# Altium schematic sheet led_matrix_board.SchDoc: MMECH23
size A3; DrawnBy: J. Garnier; SheetNumber: 1; SheetTotal: 1; PageSetup: Record=PageOptions|CenterHorizontal=True|CenterVertical=True|PrintScale=1.04|XCorrection=1.00|YCorrection=1.00|PrintKind=0|BorderSize=5000000|LeftOffset=0|BottomOffset=0|Orientation=2|PaperLength=1000|PaperWidth=1000|Scale=100|PaperSource=7|PrintQuality=-4|MediaType=1|DitherType=10|PaperKind=A3|PrintScaleMode=1
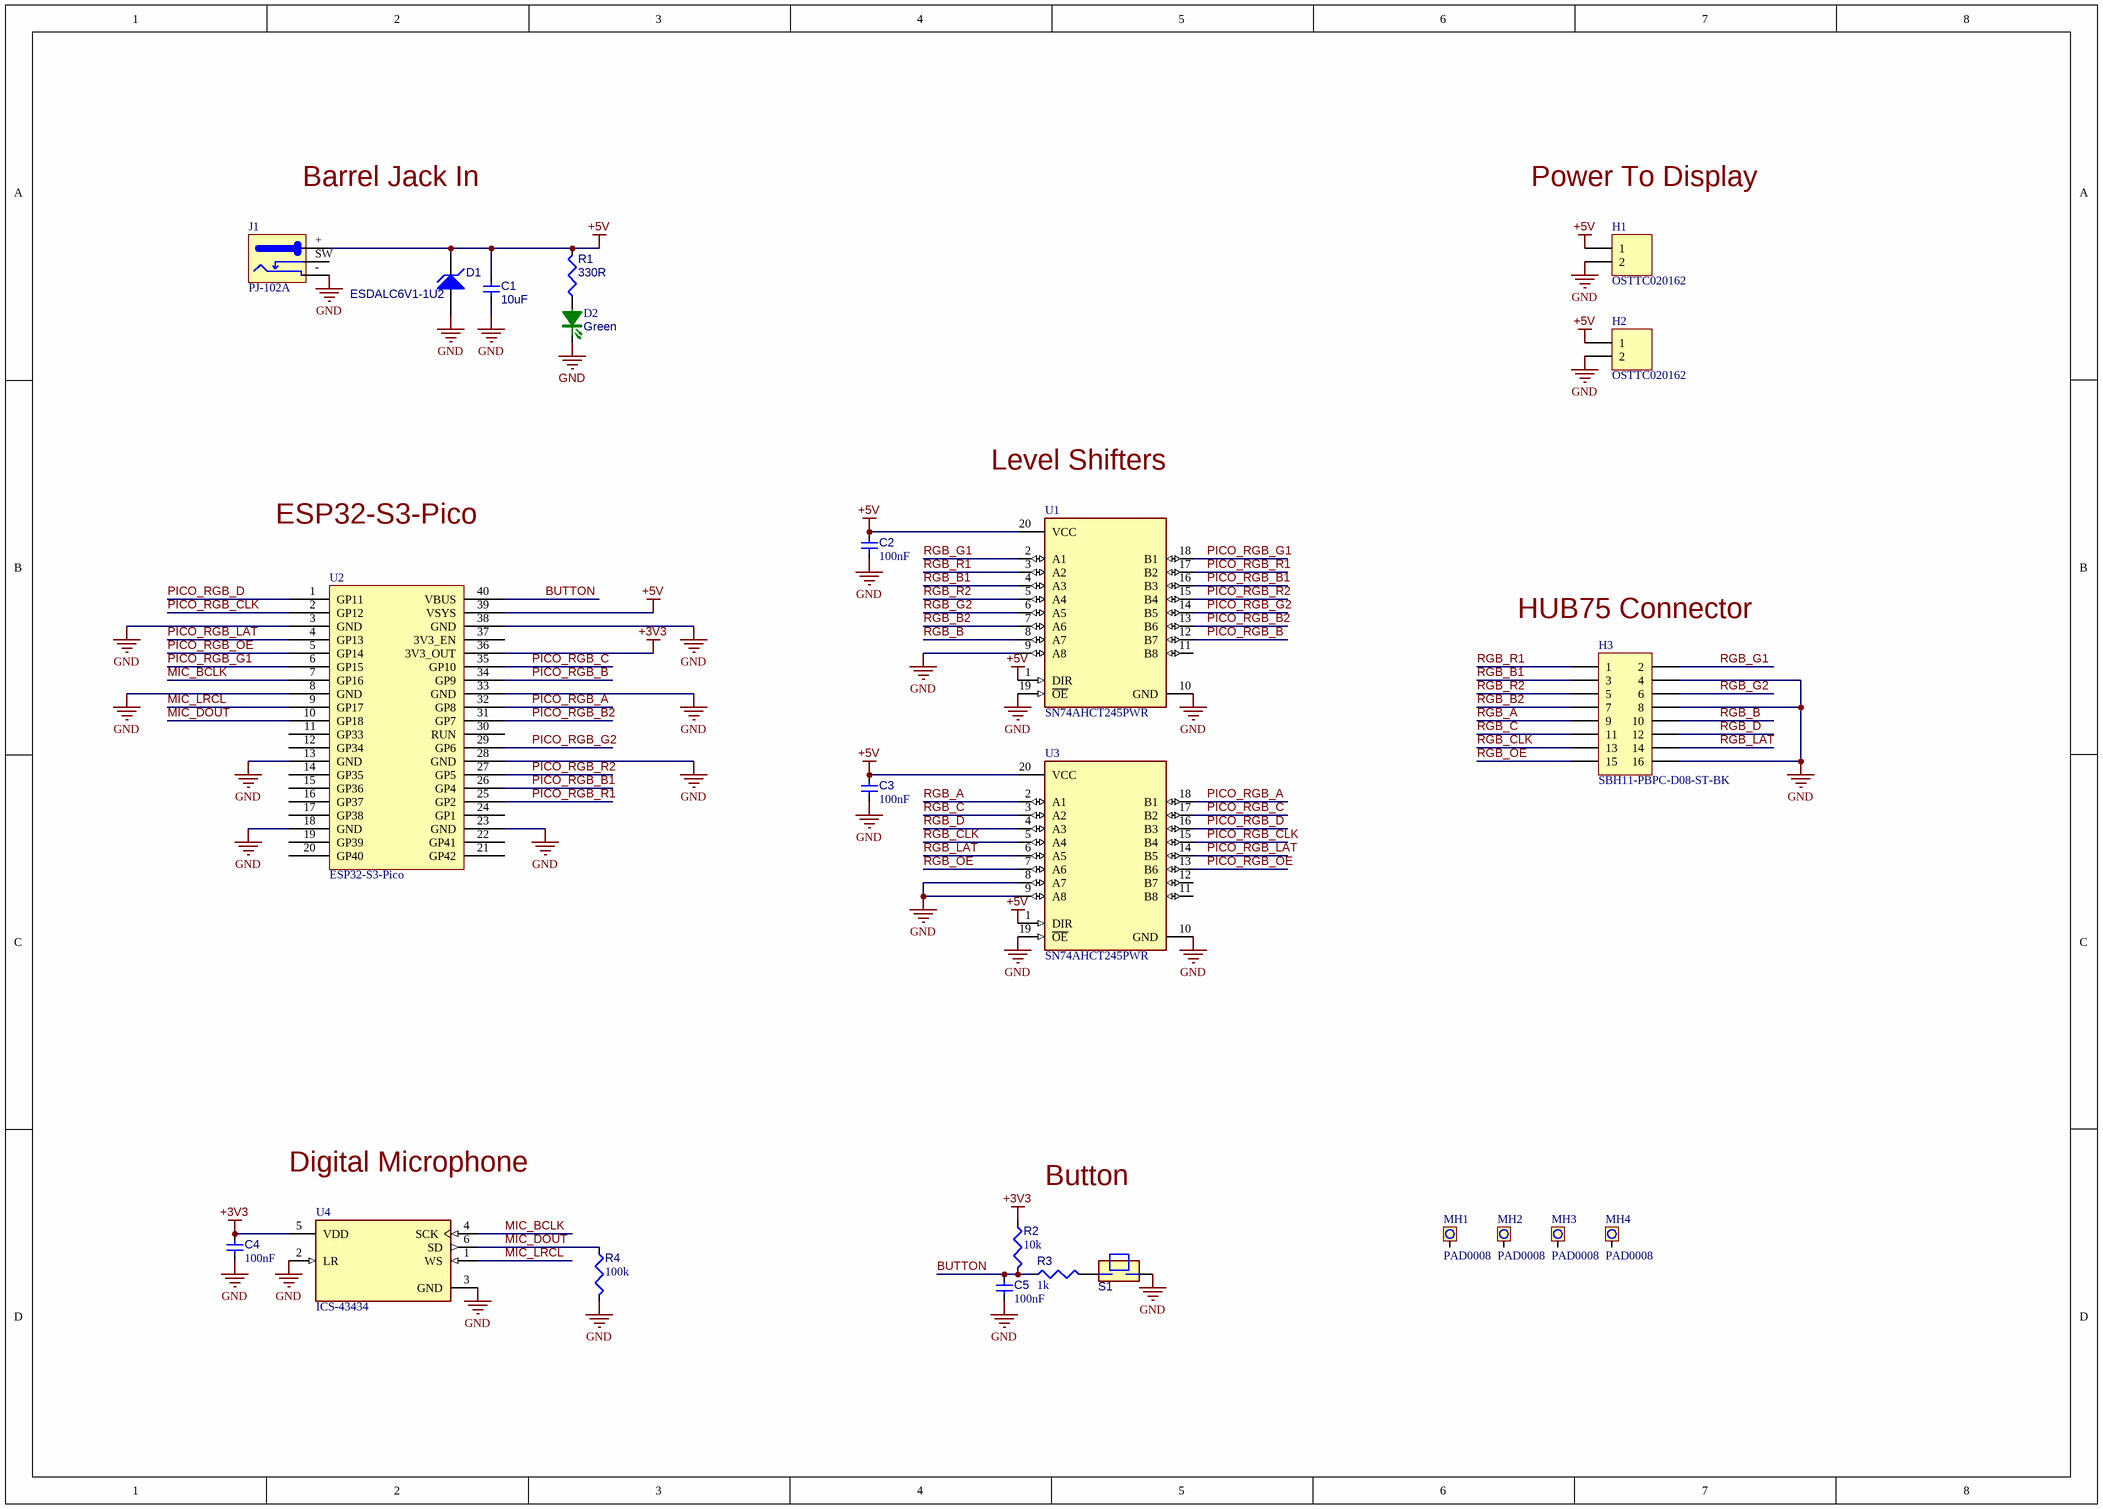
[diagram p0: led_matrix_board.SchDoc]

## Parts
C1  value 10uF  [0603_cap_rnd]  (hidden comment: GRM188R61E106MA73J)
C2  value 100nF  [0603_cap]  (hidden comment: C0603C104K8RACTU)
C3  value 100nF  [0603_cap]  (hidden comment: C0603C104K8RACTU)
C4  value 100nF  [0603_cap]  (hidden comment: C0603C104K8RACTU)
C5  value 100nF  [0603_cap]  (hidden comment: C0603C104K8RACTU)
D1  ESDALC6V1-1U2  [0201_DIODE]
D2  value Green  [LED_0402_GREEN]  (hidden comment: XZVGR68W-3)
H1  OSTTC020162  [SCREW_TERM_2WAY_5MM]
H2  OSTTC020162  [SCREW_TERM_2WAY_5MM]
H3  SBH11-PBPC-D08-ST-BK  [FP-SBH11-PBPC-D08-ST-BK-MFG]
J1  PJ-102A  [PJ-102A]
MH1  PAD0008  [MH_600_320_NPTH]
MH2  PAD0008  [MH_600_320_NPTH]
MH3  PAD0008  [MH_600_320_NPTH]
MH4  PAD0008  [MH_600_320_NPTH]
R1  value 330R  [0402_res]  (hidden comment: MCR01MZPF3300)
R2  value 10k  [0603_res]  (hidden comment: 0603WAF1002T5E)
R3  value 1k  [0603_res]  (hidden comment: ERA-3AEB102V)
R4  value 100k  [0603_res]  (hidden comment: 0603WAF1003T5E)
S1  EVQ-PF206K  [EVQ-PF206K]  (value not drawn)
U1  SN74AHCT245PWR  [FP-PW0020A-IPC_A]
U2  ESP32-S3-Pico  [ESP32-S3-Pico]
U3  SN74AHCT245PWR  [FP-PW0020A-IPC_A]
U4  ICS-43434  [FP-ICS-43434-MFG]

## Nets
+3V3: C4.1 R2.1 U2.36(3V3_OUT) U4.5(VDD)
+5V: C1.1 C2.1 C3.1 D1.K H1.1 H2.1 J1.+ R1.2 U1.1(DIR) U1.20(VCC) U2.39(VSYS) U3.1(DIR) U3.20(VCC)
GND: C1.2 C2.2 C3.2 C4.2 C5.2 D1.A D2.K H1.2 H2.2 H3.4 H3.8 H3.16 J1.- R4.2 S1.2 U1.9(A8) U1.10(GND) U1.19(~{OE}) U2.3(GND) U2.8(GND) U2.13(GND) U2.18(GND) U2.23(GND) U2.28(GND) U2.33(GND) U2.38(GND) U3.8(A7) U3.9(A8) U3.10(GND) U3.19(~{OE}) U4.2(LR) U4.3(GND)
BUTTON: C5.1 R2.2 R3.1 U2.40(VBUS)
MIC_BCLK: U2.7(GP16) U4.4(SCK)
MIC_DOUT: R4.1 U2.10(GP18) U4.6(SD)
MIC_LRCL: U2.9(GP17) U4.1(WS)
PICO_RGB_A: U2.32(GP8) U3.18(B1)
PICO_RGB_B: U1.12(B7) U2.34(GP9)
PICO_RGB_B1: U1.16(B3) U2.26(GP4)
PICO_RGB_B2: U1.13(B6) U2.31(GP7)
PICO_RGB_C: U2.35(GP10) U3.17(B2)
PICO_RGB_CLK: U2.2(GP12) U3.15(B4)
PICO_RGB_D: U2.1(GP11) U3.16(B3)
PICO_RGB_G1: U1.18(B1) U2.6(GP15)
PICO_RGB_G2: U1.14(B5) U2.29(GP6)
PICO_RGB_LAT: U2.4(GP13) U3.14(B5)
PICO_RGB_OE: U2.5(GP14) U3.13(B6)
PICO_RGB_R1: U1.17(B2) U2.25(GP2)
PICO_RGB_R2: U1.15(B4) U2.27(GP5)
RGB_A: H3.9 U3.2(A1)
RGB_B: H3.10 U1.8(A7)
RGB_B1: H3.3 U1.4(A3)
RGB_B2: H3.7 U1.7(A6)
RGB_C: H3.11 U3.3(A2)
RGB_CLK: H3.13 U3.5(A4)
RGB_D: H3.12 U3.4(A3)
RGB_G1: H3.2 U1.2(A1)
RGB_G2: H3.6 U1.6(A5)
RGB_LAT: H3.14 U3.6(A5)
RGB_OE: H3.15 U3.7(A6)
RGB_R1: H3.1 U1.3(A2)
RGB_R2: H3.5 U1.5(A4)
NetD2_A: D2.A R1.1
NetR3_2: R3.2 S1.1

Not connected (* = marked no-connect by the designer): J1 SW; MH1 1; MH2 1; MH3 1; MH4 1; U1 11(B8); U2 11(GP33) 12(GP34) 14(GP35) 15(GP36) 16(GP37) 17(GP38) 19(GP39) 20(GP40) 21(GP42) 22(GP41) 24(GP1) 30(RUN) 37(3V3_EN); U3 11(B8) 12(B7)

## Notes on the sheet
- Barrel Jack In
- Power To Display
- Level Shifters
- ESP32-S3-Pico
- (near H3) HUB75 Connector
- Digital Microphone
- (near R2) Button
- Level 8, 10-14 Waterloo Street
- Surry Hills, NSW 2010
- Drawn:
- Checked:
- Morse Micro
- Title
- AUSTRALIA
- (c) Copyright 2024
- Approved:
- Date Released:
- Drawing No:
- PCBA No:
- Drawing
- Revision:
- Size:
- A3
- File:
- Sheet
- of

## Library data of the parts
C1 = CAP0197-9: CAP CER 10UF 25V ±20% X5R 0603; Subtype: Ceramic; Generic Allowed: Yes; ClassName: CHIP_OTHER; Tolerance: 20%; Component Rating: X5R; Package: 0603; Voltage: 25V
C2-C5 = CAP0030-8: CAP CER 100NF 10V ±10% X7R 0603; Generic Allowed: Yes; Subtype: Ceramic; Tolerance: 10%; ClassName: CHIP_OTHER; Package: 0603; Voltage: 10V; Component Rating: X7R
D1 = DIO0043-4: TVS DIODE 3VWM ST020; Generic Allowed: No; Voltage: 3V; Power: 20W; Value: ESDALC6V1-1U2; Package: 0201; ClassName: CHIP_MICRO
D2 = DIO0053-6: LED GREEN 0402 SMD; Generic Allowed: Yes; Voltage: 2.0V; ClassName: CHIP_OTHER; Package: 0402
H1 H2 = JCK0020-1: CONN TERM BLOCK 5MM 2POS; Generic Allowed: Yes; ClassName: COMP_OTHER; Package: THRU-Hole
H3 = HDR0159-1: Conn Shrouded Header (4 Sides) HDR 16 POS 2.54mm Solder ST Top Entry Thru-Hole
J1 = JCK0011-1: Conn Power Jack 2.1mm PCB Mount Thru-Hole; Generic Allowed: No; ClassName: COMP_OTHER; Package: THRU-Hole
MH1-MH4 = PAD0008-2: MH 6.00MM DIA 3.2MM HOLE NPTH; Shape: Round; ClassName: PCB_PATTERN
R1 = RES0073-11: RES SMD 330R OHM ±1% 1/16W 0402; Generic Allowed: Yes; ClassName: CHIP_MICRO; Package: 0402; Power: 1/16W; Tolerance: 1%
R2 = RES0219-8: RES SMD 10K OHM ±1% 1/10W 0603; Generic Allowed: Yes; Subtype: Thick Film; Power: 1/10W; Tolerance: 1%; Package: 0603; ClassName: CHIP_MICRO
R3 = RES0105-8: RES SMD 1K OHM ±0 .1% 1/10W 0603; Tolerance: 0 .1%; Generic Allowed: Yes; Power: 1/10W; ClassName: CHIP_OTHER; Package: 0603
R4 = RES0224-8: RES SMD 100K OHM ±1% 1/10W 0603; Subtype: Thick Film; Generic Allowed: Yes; ClassName: CHIP_MICRO; Power: 1/10W; Package: 0603; Tolerance: 1%
S1 = SWH0003-1: SW, Tactile 15V@20mA, EVQ-PF, Through Hole, R/A, 7.5x7.1x5.85mm; Generic Allowed: Yes; ClassName: COMP_OTHER; Package: EVQ-PF206K
U1 U3 = ICT0294-1: 8mA 8 4.5V~5.5V 8mA 1 TSSOP-20 Buffer/Driver/Transceiver ROHS; Manufacturer Lifecycle Status: ACTIVE; Quiescent Current: 4µA; Direction: Bidirectional; Operating Supply Voltage: 5V; Polarity: Non-Inverting; Number of Bits per Element: 8; Number of Elements: 1; Propagation Delay: 5.3ns; Max Supply Voltage: 5.5V; Turn-On Delay Time: 16.5ns; High Level Output Current: -8mA; Min Supply Voltage: 4.5V; Logic Function: Inverting, Transceiver; Thickness: 1mm; Pins: 20; Radiation Hardening: No; Lifecycle Status: Production; Number of Bits: 8; Max Operating Temperature: 125°C; RoHS: Compliant; Nominal Supply Current: 4µA; Case/Package: TSSOP; Number of Channels: 8; Height: 0m; Mounting Technology: Surface Mount; Width: 4.4mm; Number of Inputs: 8; Number of Outputs: 8; Min Operating Temperature: -40°C; Schedule B: 8542390000, 8542390000; Weight: 76.997305mg; REACH SVHC: No; Ambient Temperature Range High: 125°C; Lead Free: Lead Free; Number of Circuits: 1; Low Level Output Current: 8mA; Length: 6.5mm; Contact Plating: Gold
U2 = MOD0041-1: ESP32-S3-Pico Module.
U4 = CMP-00035-1: Mic Omni-Directional -26dB 3.63V Rectangular Solder Pad T/R; Operating Supply Current: 550µA; Min Supply Voltage: 1.65V; Direction: Omnidirectional; Output Type: Digital; Min Operating Temperature: -40°C; Min Thickness: 880µm; Max Length: 3.6mm; Max Operating Temperature: 85°C; Max Thickness: 1.08mm; Min Length: 3.4mm; Width: 2.65mm; Schedule B: 8518100000, 8518100000; Min Width: 2.55mm; Lifecycle Status: Production; Max Supply Voltage: 3.63V; RoHS: Compliant; Length: 3.5mm; Height: 980µm; Max Width: 2.75mm